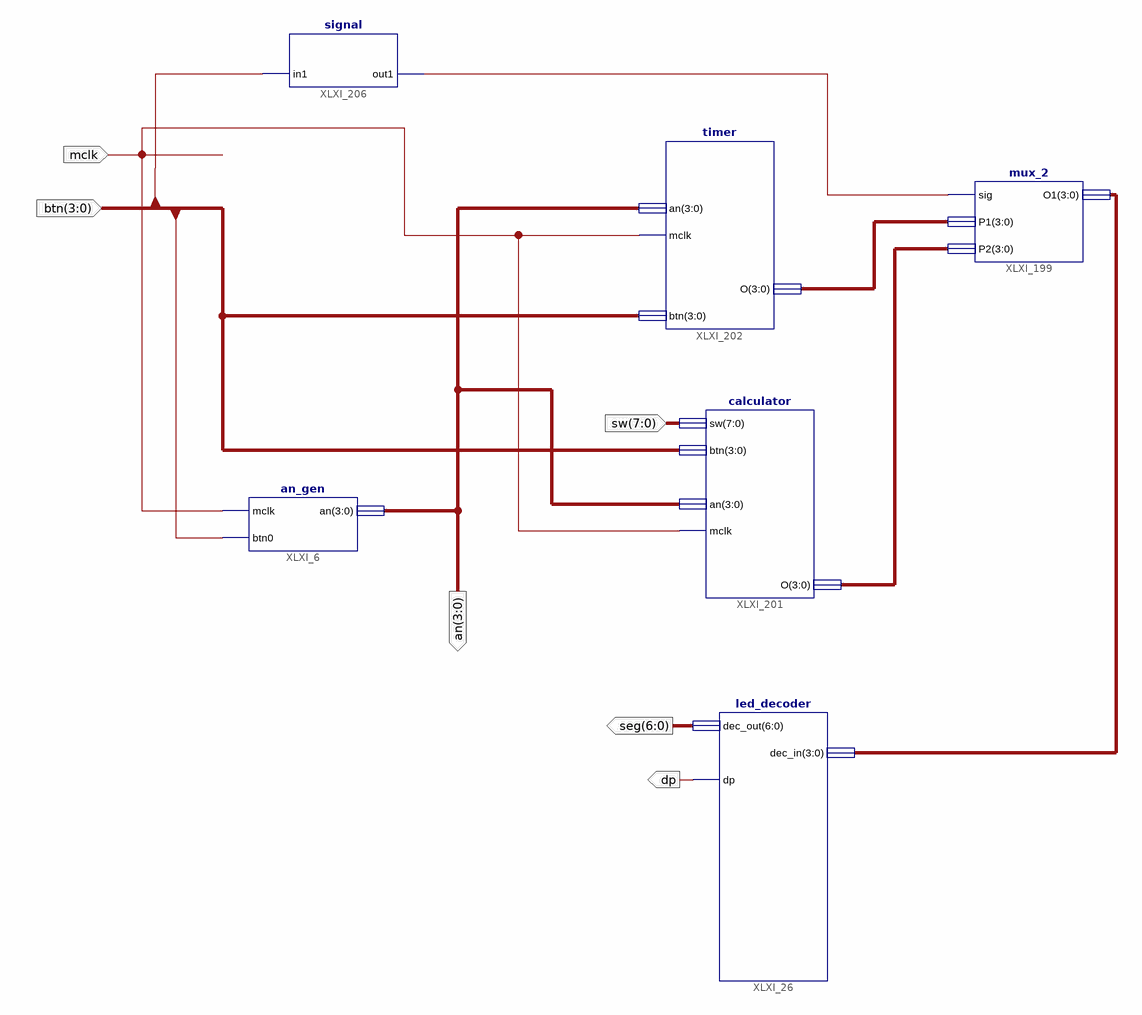
[diagram p0: schematic sheet 1]
// Xilinx ISE schematic main.sch (spartan3e) as structural Verilog: 6 symbols, 6 ports
module main (
  input  mclk,
  input  [7:0] sw,
  input  [3:0] btn,
  output [3:0] an,
  output [6:0] seg,
  output dp
);

  wire XLXN_360;
  wire [3:0] XLXN_338, XLXN_363, XLXN_364;

  an_gen XLXI_6 (.mclk(mclk), .btn0(btn[0]), .an(an));
  mux_2 XLXI_199 (.sig(XLXN_360), .P1(XLXN_363), .P2(XLXN_364), .O1(XLXN_338));
  timer XLXI_202 (.an(an), .mclk(mclk), .O(XLXN_363), .btn(btn));
  led_decoder XLXI_26 (.dec_in(XLXN_338), .dp(dp), .dec_out(seg));
  calculator XLXI_201 (.sw(sw), .btn(btn), .an(an), .mclk(mclk), .O(XLXN_364));
  signal XLXI_206 (.in1(btn[3]), .out1(XLXN_360));
endmodule
